# EAGLE design TrinketTrigger (EAGLE 9.6.2)
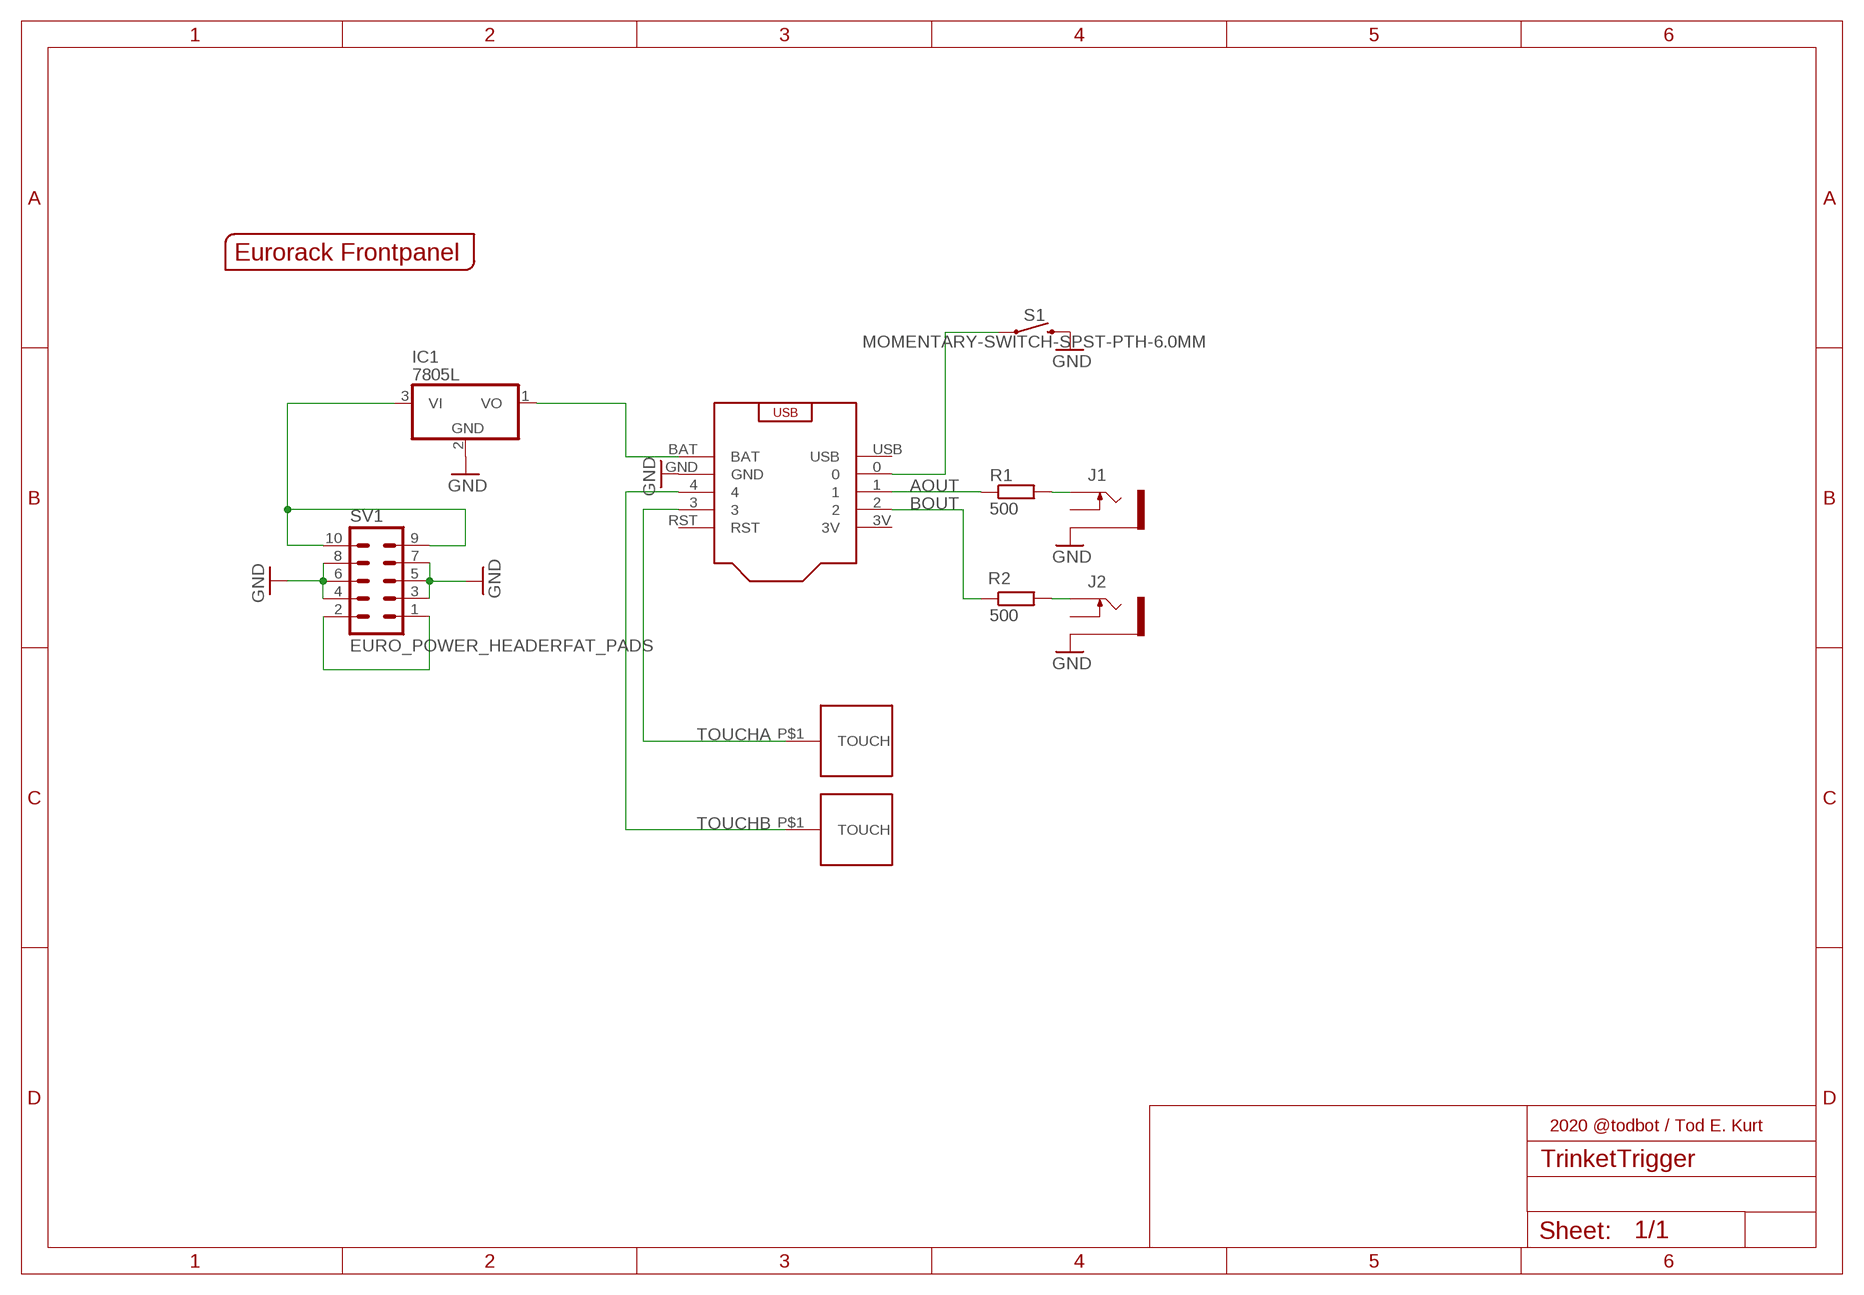
[diagram p0: schematic, sheet 1]

## Parts
IC1  7805L  [TO92]
J1  THONKICONNNEW  [WQP-PJ301M-12_JACK]
J2  THONKICONNNEW  [WQP-PJ301M-12_JACK]
R1  500  R-EU_0204/7  [0204/7]
R2  500  R-EU_0204/7  [0204/7]
S1  MOMENTARY-SWITCH-SPST-PTH-6.0MM  [TACTILE_SWITCH_PTH_6.0MM]
SV1  EURO_POWER_HEADERFAT_PADS  [EURO_PWR_HEADER_FAT]
TOUCHA  TOUCHPADA  [TOUCHPADA]
TOUCHB  TOUCHPADA  [TOUCHPADA]
U$1  EURORACK_PANEL6HP  [EURORACK6HPPANEL]
U$2  TRINKETM0NH  [TRINKETMO_NOHOLES]

## Nets
AOUT: R1.1 U$2.1
BOUT: R2.1 U$2.2
GND: IC1.2(GND) J1.P$3_SLEEVE(SLEEVE) J2.P$3_SLEEVE(SLEEVE) S1.3 SV1.3 SV1.4 SV1.5 SV1.6 SV1.7 SV1.8 U$2.GND
N$1: J1.P$1_TIP(TIP) R1.2
N$2: SV1.1 SV1.2
N$3: S1.1 U$2.0
N$4: J2.P$1_TIP(TIP) R2.2
N$5: IC1.1(VO) U$2.BAT
N$6: IC1.3(VI) SV1.9 SV1.10
TOUCHA: TOUCHA.P$1(TOUCH) U$2.3
TOUCHB: TOUCHB.P$1(TOUCH) U$2.4
Unconnected: J1.P$2_SWITCH(SWITCH) J2.P$2_SWITCH(SWITCH) U$2.3V U$2.RST U$2.USB

## Notes on the sheet
- 2020 @todbot / Tod E. Kurt

## Library data of the parts
IC1 = adafruit:78*: Positive VOLTAGE REGULATOR Added bigger pads to the TO-92 package
J1 J2 = MusicThingModular:THONKICONN: 3.5mm socket for Eurorack modular synths
R1 R2 = rcl:R-EU_: RESISTOR, European symbol; SPICEPREFIX: R
S1 = SparkFun-Switches:MOMENTARY-SWITCH-SPST: Momentary Switch (Pushbutton) - SPST Normally-open (NO) SPST momentary switches (buttons, pushbuttons). Variants PTH-12MM - 12mm square, through-hole Momentary Pushbutton Switch - 12mm Square <https://www.sparkfun.com/products/9190> (COM-09190) PTH-6.0MM, PTH-6.0MM-KIT - 6.0mm square, through-hole Mini Pushbutton Switch <https://www.sparkfun.com/products/97> (COM-00097) KIT package intended for soldering kit's - only one side of pads' copper is exposed. PTH-RIGHT-ANGLE-KIT - Right-angle, through-hole Right Angle Tactile Button <https://www.sparkfun.com/products/10791> - Used on SparkFun BigTime Watch Kit <https://www.sparkfun.com/products/11734> SMD-12MM - 12mm square, surface-mount Tactile Button - SMD (12mm) <https://www.sparkfun.com/products/12993> (COM-12993) Used on SparkFun PicoBoard <https://www.sparkfun.com/products/11888> SMD-4.5MM - 4.5mm Square Trackball Switch Used on SparkFun Blackberry Trackballer Breakout <https://www.sparkfun.com/products/13169> SMD-4.6MMX2.8MM - 4.60mm x 2.80mm, surface mount Used on SparkFun SAMD21 Mini Breakout <https://www.sparkfun.com/products/13664> SMD-5.2MM, SMD-5.2-REDUNDANT - 5.2mm square, surface-mount Mini Pushbutton Switch - SMD <https://www.sparkfun.com/products/8720> (COM-08720) Used on Arduino Pro Mini <https://www.sparkfun.com/products/11114> REDUNDANT package connects both switch circuits together SMD-6.0X3.5MM - 6.0 x 3.5mm, surface mount Momentary Reset Switch SMD <https://www.sparkfun.com/products/8229> (COM-08229) SMD-6.2MM-TALL - 6.2mm square, surface mount Tactile Button - SMD (6mm) <https://www.sparkfun.com/products/12992> Used on SparkFun Digital Sandbox <https://www.sparkfun.com/products/12651> SMD-RIGHT-ANGLE - Right-angle, surface mount Used on SparkFun Block for Intel® Edison - Arduino <https://www.sparkfun.com/products/13036>; PROD_ID: SWCH-08441; SF_SKU: COM-00097
SV1 = MusicThingModular:EURO_POWER_HEADER: Power Header 10 pin power header for Eurorack Power Supplies Variants with fatter pads for easier soldering, and the LOCK variant which has 5mil offset pins to hold the component in place before soldering
TOUCHA TOUCHB = todstuff:TOUCHPAD
U$1 = EurorackModularParts:EURORACK_PANEL
U$2 = todstuff:TRINKETM0

## Board
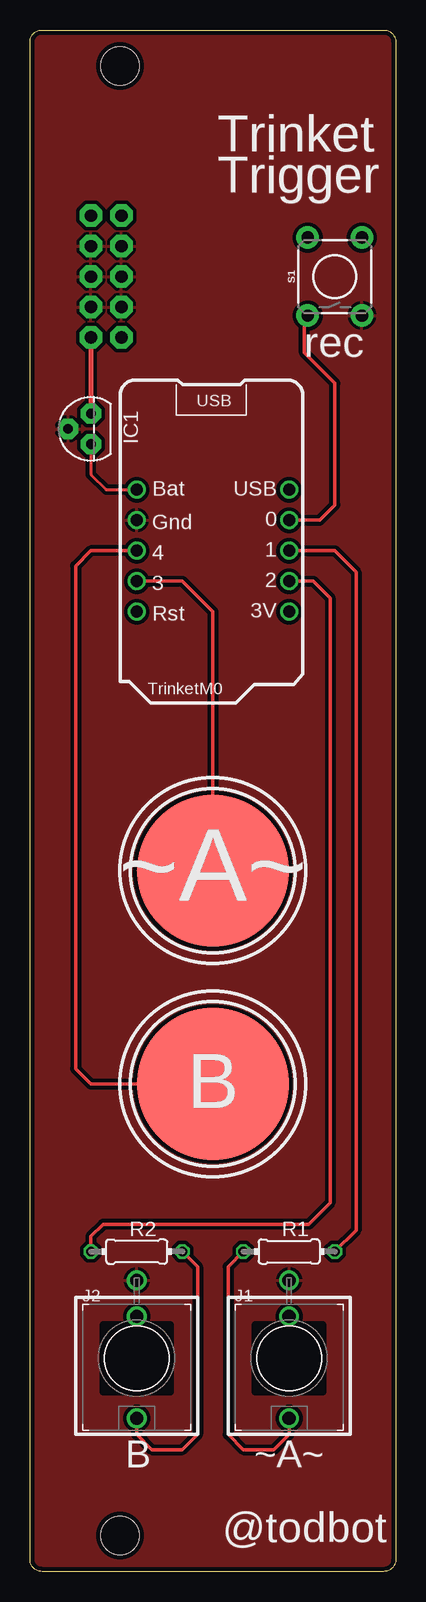
[diagram p1: board, top side]
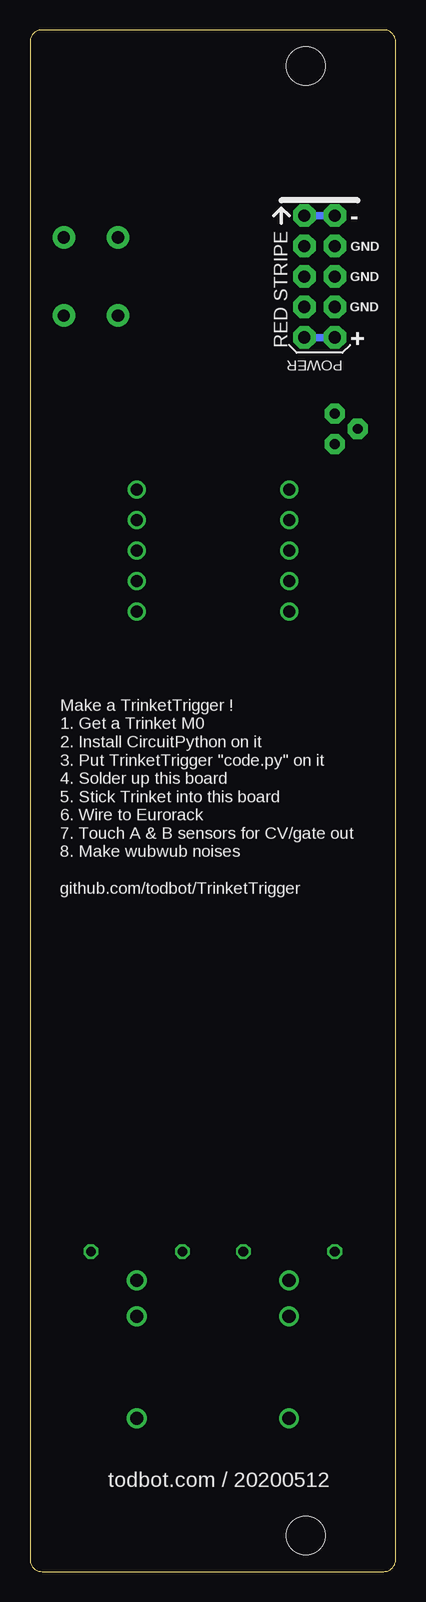
[diagram p2: board, bottom side, seen from below]

Size 30.48 x 128.5 mm. Coordinates in mm from the lower left corner, seen from the top.
Copper layers (1*16): Top 0.0356mm / dielectric 1.5011mm / Bottom 0.0356mm
Design rules "LaenPCBOrderTodTent": minimum track width 6mil, minimum drill 13mil, track to track 6mil, track to pad 6mil, pad to pad 6mil, via to via 6mil, smd to smd 6mil, copper to edge 15mil, drill to drill 6mil, minimum pad ring 7mil, minimum via ring 7mil, stop-mask expansion 3mil, vias tented up to drill 20mil, thermal gap 10mil

### Footprints (pad centres in the part's own frame; a part is rotated, then mirrored left to right if it is on the bottom)
TO92 = drill 0.813 pad 1.676 octagon: 1 -1.27,0; 2 0,1.905; 3 1.27,0
WQP-PJ301M-12_JACK = drill 1.1: P$1_TIP 0,5; P$2_SWITCH 0,-3.5; P$3_SLEEVE 0,-6.5
0204/7 = drill 0.813 octagon: 1 -3.81,0; 2 3.81,0
TACTILE_SWITCH_PTH_6.0MM = drill 1.016 pad 1.88: 1 -3.251,2.261; 2 3.251,2.261; 3 -3.251,-2.261; 4 3.251,-2.261
EURO_PWR_HEADER_FAT = drill 1.016 pad 1.88 octagon: 1 -5.08,-1.27; 2 -5.08,1.27; 3 -2.54,-1.27; 4 -2.54,1.27; 5 0,-1.27; 6 0,1.27; 7 2.54,-1.27; 8 2.54,1.27; 9 5.08,-1.27; 10 5.08,1.27
TOUCHPADA = smd 12.7 x 12.7: P$1 0,0
EURORACK6HPPANEL = hole 3.2: 7.5,3; 7.5,125.5
TRINKETMO_NOHOLES = drill 1: 0 -2.54,6.35; 1 0,6.35; 2 2.54,6.35; 3 2.54,-6.35; 3V 5.08,6.35; 4 0,-6.35; BAT -5.08,-6.35; GND -2.54,-6.35; RST 5.08,-6.35; USB -5.08,6.35

### Placement (x,y rotation side)
IC1  5.08,95.25 90 top
J1  21.59,17.78 180 top
J2  8.89,17.78 180 top
R1  21.59,26.67 180 top
R2  8.89,26.67 0 top
S1  25.4,107.95 90 top
SV1  6.35,107.95 270 bottom
TOUCHA  15.24,58.42 0 top
TOUCHB  15.24,40.64 0 top
U$1  0,0 0 top
U$2  15.24,85.09 270 top

### Tracks (layer width: path | path; a pad name or v marks a point on that pad's centre or on a via)
AOUT
  Top 0.305: U$2.1 25.4,85.09 27.18,83.31 27.18,28.45 R1.1
BOUT
  Top 0.305: U$2.2 23.62,82.55 25.02,81.15 25.02,30.73 23.24,28.96 6.1,28.96 5.08,27.94 R2.1
GND
  pour Top (isolate 0.305): 0,128.27 30.65,128.27 30.65,-1.27 0,-1.27
N$1
  Top 0.305: R1.2 16.51,25.4 16.51,11.43 17.78,10.16 20.32,10.16 21.59,11.43 J1.P$1_TIP
N$2
  Bottom 0.61: SV1.1 SV1.2
N$3
  Top 0.305: U$2.0 24.13,87.63 25.4,88.9 25.4,99.06 22.86,101.6 22.86,104.42 S1.1
N$4
  Top 0.305: R2.2 13.97,25.4 13.97,11.43 12.7,10.16 10.16,10.16 8.89,11.43 J2.P$1_TIP
N$5
  Top 0.254: IC1.1 5.08,91.44 6.35,90.17 U$2.BAT
N$6
  Top 0.406: SV1.10 IC1.3
  Bottom 0.61: SV1.9 SV1.10
TOUCHA
  Top 0.305: U$2.3 12.7,82.55 15.24,80.01 TOUCHA.P$1
TOUCHB
  Top 0.305: U$2.4 5.08,85.09 3.81,83.82 3.81,41.91 5.08,40.64 TOUCHB.P$1

### Text on the board
tPlace: Trinket | Trigger | rec | ~A~ | B | B | ~A~
bPlace: Make a TrinketTrigger ! / 1. Get a Trinket M0 / 2. Install CircuitPython on it / 3. Put TrinketTrigger "code.py" on it / 4. Solder up this board / 5. Stick Trinket into this board / 6. Wire to Eurorack / 7. Touch A & B sensors for CV/gate out / 8. Make wubwub noises / / github.com/todbot/TrinketTrigger | todbot.com / 20200512
tNames: @todbot
200bmp: /Users/tod/Desktop/TrinketTriggerD.bmp